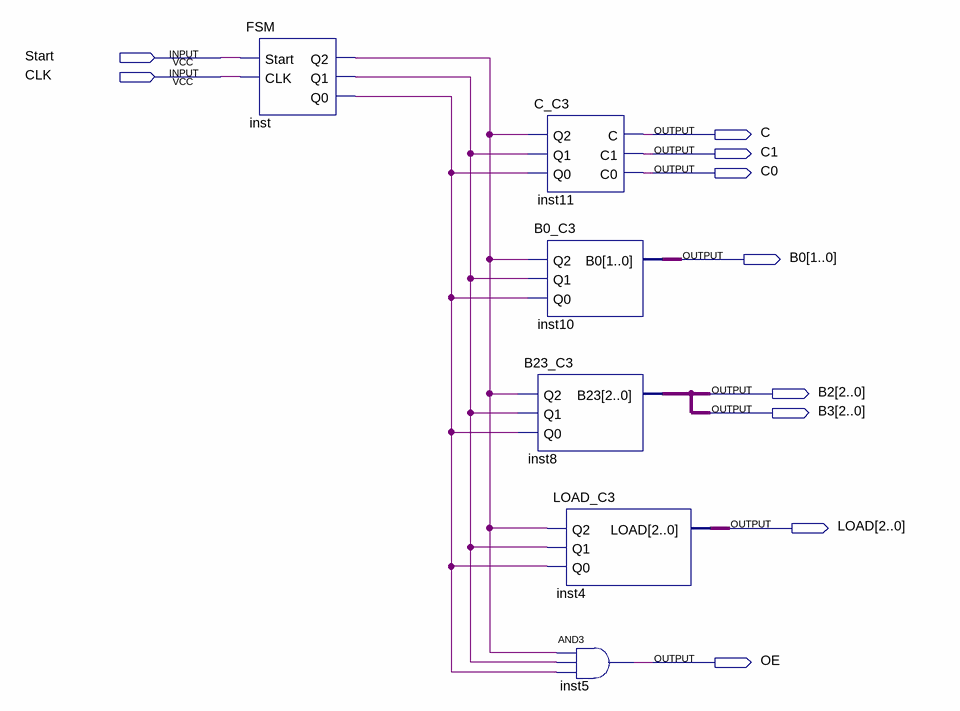
[diagram p0: schematic sheet]
// Quartus schematic Controller3.bdf as structural Verilog: 6 symbols, 10 pins
module Controller3 (
  input  Start,
  input  CLK,
  output C,
  output C1,
  output C0,
  output [1:0] B0,
  output [2:0] B2,
  output [2:0] B3,
  output [2:0] LOAD,
  output OE
);

  wire inst_q0, inst_q1, inst_q2;

  FSM inst (.Start(Start), .CLK(CLK), .Q2(inst_q2), .Q1(inst_q1), .Q0(inst_q0));
  B23_C3 inst8 (.Q2(inst_q2), .Q1(inst_q1), .Q0(inst_q0), .B23(B2));
  C_C3 inst11 (.Q2(inst_q2), .Q1(inst_q1), .Q0(inst_q0), .C(C), .C1(C1), .C0(C0));
  B0_C3 inst10 (.Q2(inst_q2), .Q1(inst_q1), .Q0(inst_q0), .B0(B0));
  LOAD_C3 inst4 (.Q2(inst_q2), .Q1(inst_q1), .Q0(inst_q0), .LOAD(LOAD));
  and inst5 (OE, inst_q2, inst_q1, inst_q0);

  assign B3 = B2;
endmodule
